# Altium schematic sheet Reversion_History_Schematic.SchDoc
size A3; SheetNumber: 1; SheetTotal: 5
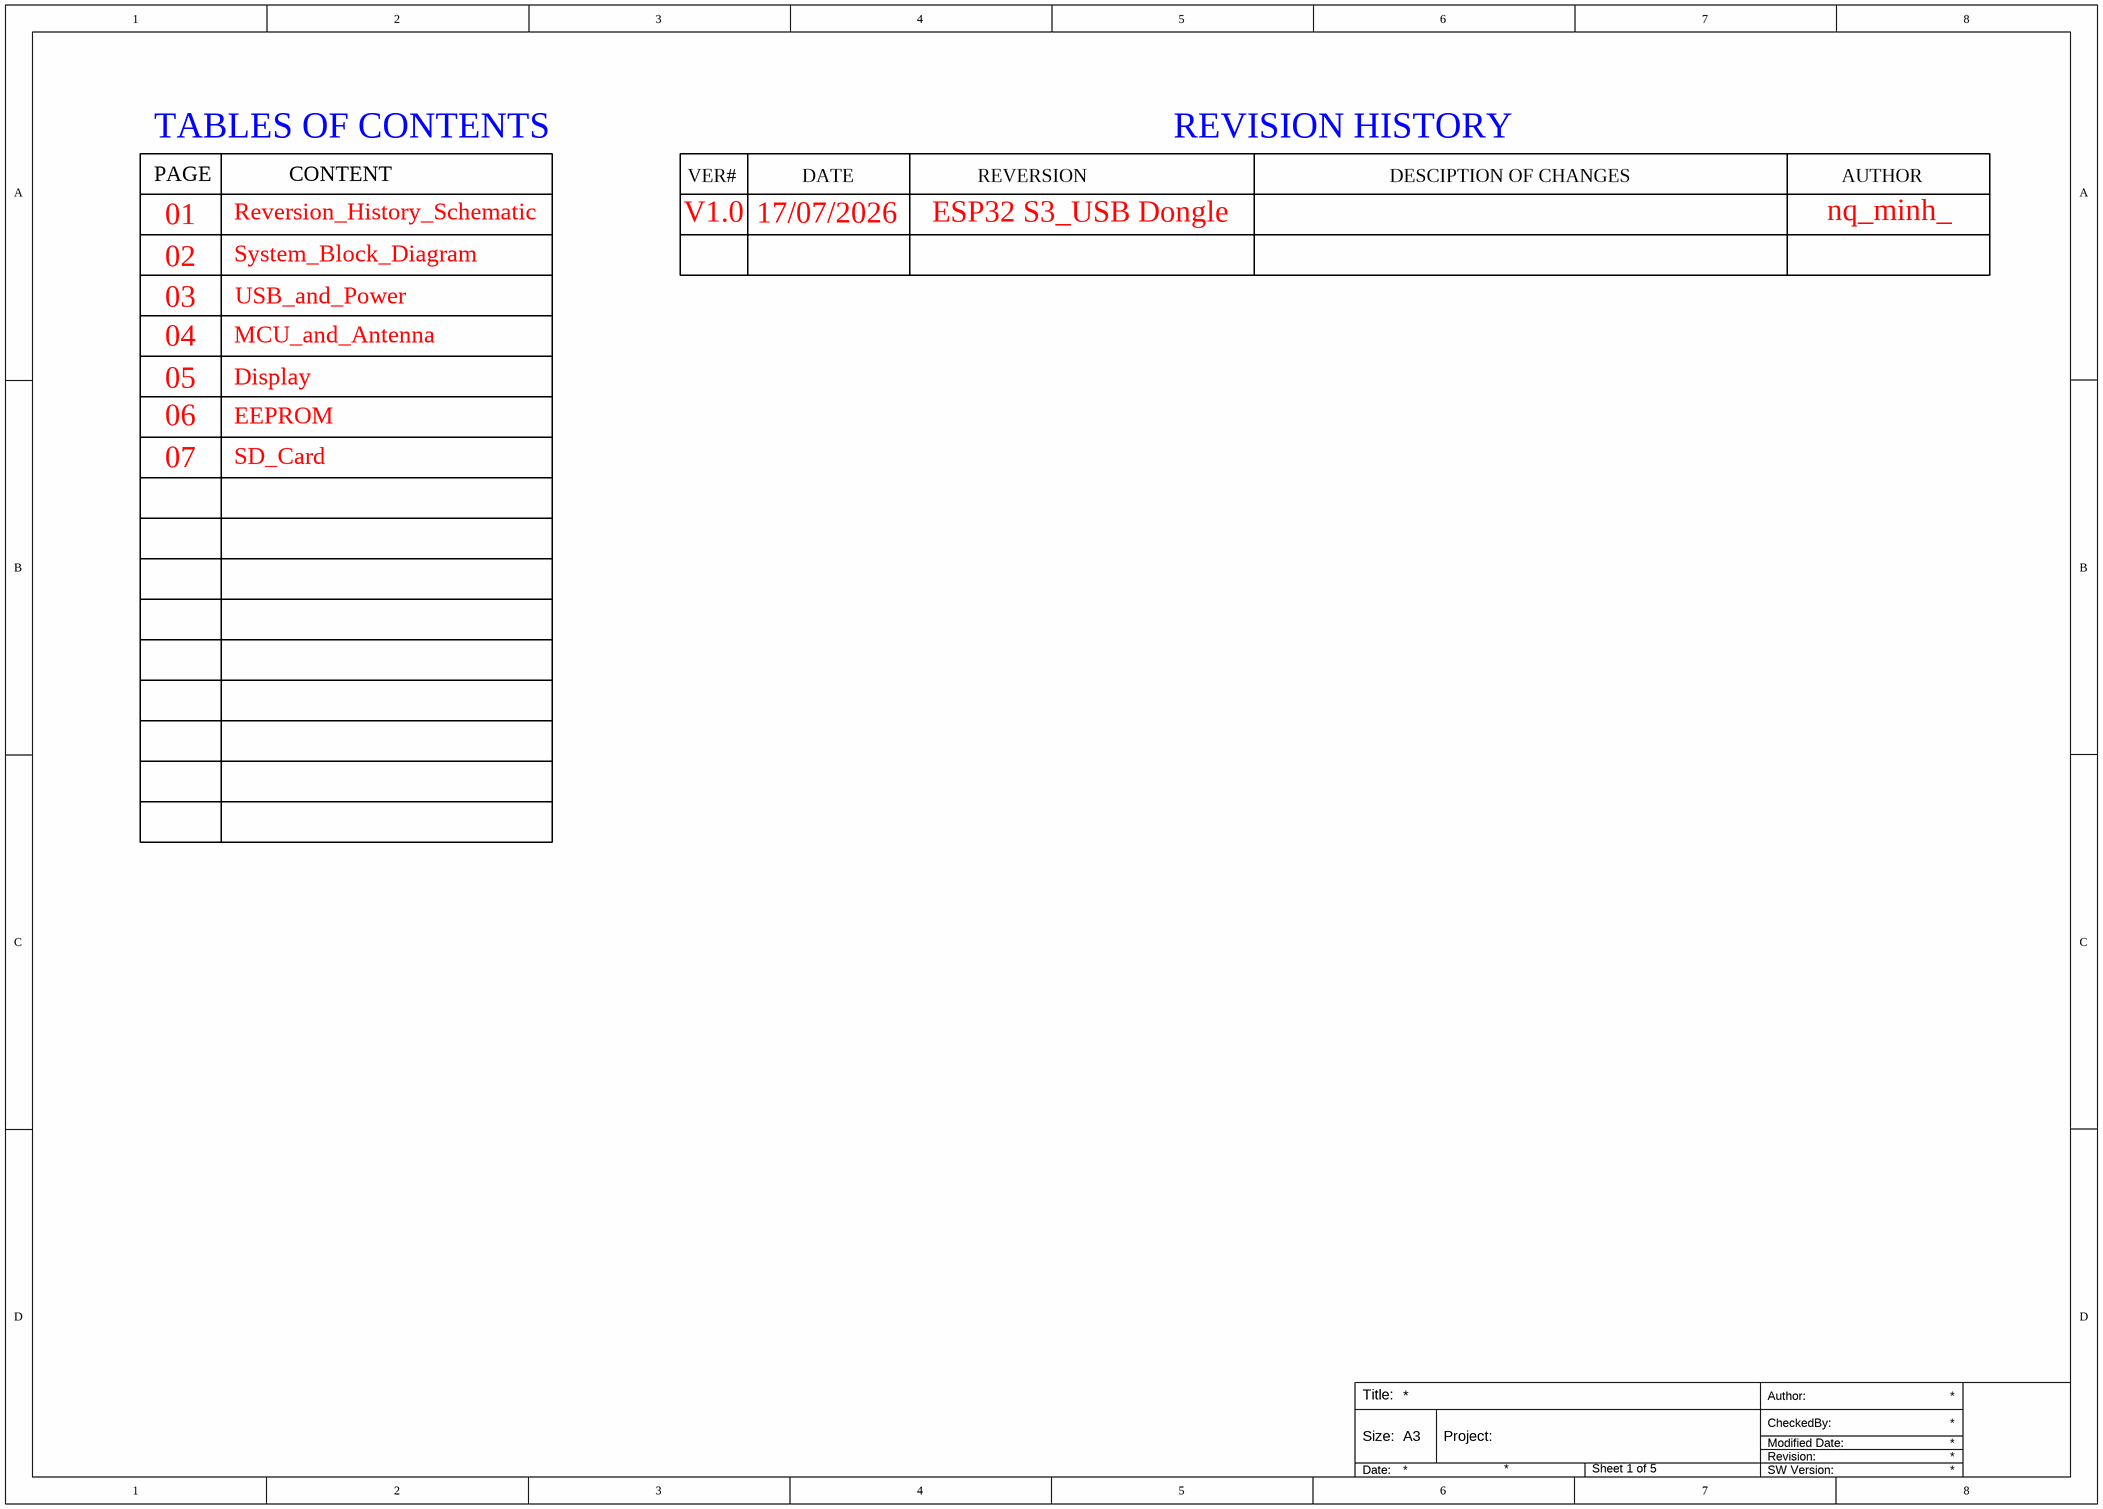
[diagram p0: Reversion_History_Schematic.SchDoc]

## Notes on the sheet
- 01
- Reversion_History_Schematic
- V1.0
- 17/07/2026
- ESP32 S3_USB Dongle
- nq_minh_
- 02
- 03
- System_Block_Diagram
- USB_and_Power
- 04
- MCU_and_Antenna
- 05
- 06
- Display
- EEPROM
- 07
- SD_Card
- TABLES OF CONTENTS
- PAGE
- CONTENT
- VER#
- DATE
- REVERSION
- REVISION HISTORY
- DESCIPTION OF CHANGES
- AUTHOR
- Author:
- Title:
- Size:
- A3
- Project:
- Revision:
- Modified Date:
- CheckedBy:
- Date:
- SW Version: